# Altium schematic sheet Sheet4_PSU.SchDoc: =ProjectName
size A4; DocumentNumber: 4; SheetNumber: 4; SheetTotal: 4
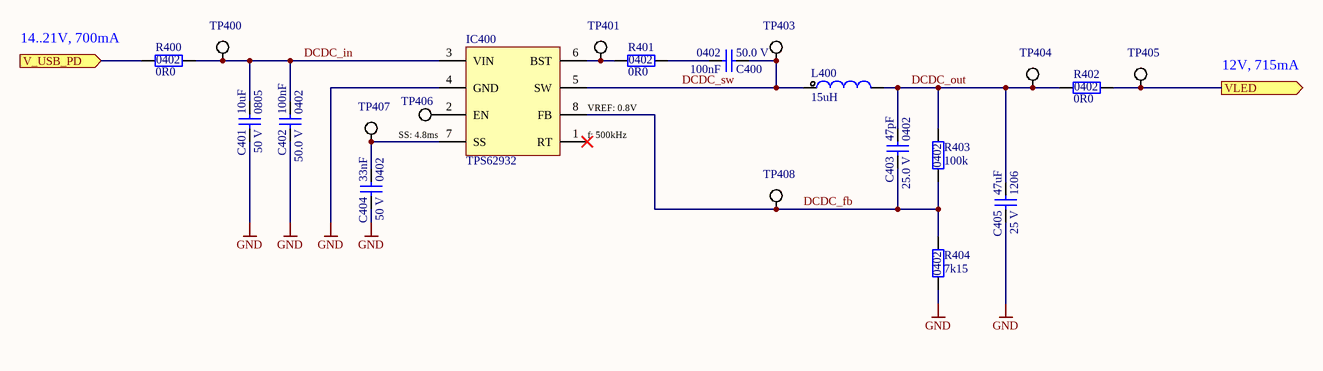
[diagram p0: Sheet4_PSU.SchDoc]

## Parts
C400  Capacitance: 100nF  Footprint: 0402  Voltage: 50.0 V  [C_0402]  (hidden comment: C 100nF 0402 50V)
C401  Capacitance: 10uF  Footprint: 0805  Voltage: 50 V  [C_0805]  (hidden comment: C 10uF 0805 50V)
C402  Capacitance: 100nF  Footprint: 0402  Voltage: 50.0 V  [C_0402]  (hidden comment: C 100nF 0402 50V)
C403  Capacitance: 47pF  Footprint: 0402  Voltage: 25.0 V  [C_0402]  (hidden comment: C 47pF 0402 25V)
C404  Capacitance: 33nF  Footprint: 0402  Voltage: 50 V  [C_0402]  (hidden comment: C 33nF 0402 50V)
C405  Capacitance: 47uF  Footprint: 1206  Voltage: 25 V  [C_1206]  (hidden comment: C 47uF 1206 25V)
IC400  TPS62932  [SOT-583]
L400  Inductance: 15uH  [L_7447709150]  (hidden comment: L 15uH 6.5A)
R400  Resistance: 0R0  Footprint: 0402  [R_0402]  (hidden comment: R 0R0 0402)
R401  Resistance: 0R0  Footprint: 0402  [R_0402]  (hidden comment: R 0R0 0402)
R402  Resistance: 0R0  Footprint: 0402  [R_0402]  (hidden comment: R 0R0 0402)
R403  Resistance: 100k  Footprint: 0402  [R_0402]  (hidden comment: R 100k 0402)
R404  Resistance: 7k15  Footprint: 0402  [R_0402]  (hidden comment: R 7k15 0402)
TP400  TP  [TP_1mm]  (value not drawn)  (net tie, no BOM)
TP401  TP  [TP_1mm]  (value not drawn)  (net tie, no BOM)
TP403  TP  [TP_1mm]  (value not drawn)  (net tie, no BOM)
TP404  TP  [TP_1mm]  (value not drawn)  (net tie, no BOM)
TP405  TP  [TP_1mm]  (value not drawn)  (net tie, no BOM)
TP406  TP  [TP_1mm]  (value not drawn)  (net tie, no BOM)
TP407  TP  [TP_1mm]  (value not drawn)  (net tie, no BOM)
TP408  TP  [TP_1mm]  (value not drawn)  (net tie, no BOM)

## Ports
V_USB_PD (in), VLED (out)

## Nets
GND: C401.1 C402.1 C404.1 C405.1 IC400.4(GND) R404.1
DCDC_fb: C403.1 IC400.8(FB) R403.1 R404.2 TP408.1(TP)
DCDC_in: C401.2 C402.2 IC400.3(VIN) R400.2 TP400.1(TP)
DCDC_out: C403.2 C405.2 L400.2 R402.1 R403.2 TP404.1(TP)
DCDC_sw: C400.1 IC400.5(SW) L400.1 TP403.1(TP)
V_USB_PD: R400.1 ; port V_USB_PD
VLED: R402.2 TP405.1(TP) ; port VLED
NetC400_2: C400.2 R401.2
NetC404_2: C404.2 IC400.7(SS) TP407.1(TP)
NetIC400_2: IC400.2(EN) TP406.1(TP)
NetIC400_6: IC400.6(BST) R401.1 TP401.1(TP)

Not connected (* = marked no-connect by the designer): IC400 1(RT)*

## Notes on the sheet
- (near R400) 14..21V, 700mA
- VREF: 0.8V
- 12V, 715mA
- SS: 4.8ms
- (near IC400) f: 500kHz
- Title
- Size:
- Date:
- A4
- Number:
- Time:
- Revision:
- Sheet
- of
- File:

## Library data of the parts
C400 C402 = CAP_100nF_50V_0402: CAP CER 0.1UF 50V X7R 0402; Manufacturer: Murata Electronics; Manufacturer Part Number: GRM155R71H104KE14J; Type: Capacitor; Supplier 1: Digi-Key; Supplier Part Number 1: 490-13342-1-ND
C401 = CAP_10uF_50V_0805: CAP CER 10UF 50V X5R 0805; Manufacturer: Murata Electronics; Manufacturer Part Number: GRM21BR61H106KE43K; Type: Capacitor; Supplier 1: Digi-Key; Supplier Part Number 1: 490-GRM21BR61H106KE43KTR-ND
C403 = CAP_47pF_25V_0402: CAP CER 47PF 25V C0G/NP0 0402; Manufacturer: KEMET; Manufacturer Part Number: C0402C470J3GAC7867; Type: Capacitor; Supplier 1: Digi-Key; Supplier Part Number 1: 399-C0402C470J3GAC7867CT-ND
C404 = CAP_33nF_50V_0402: CAP CER 0.033UF 50V X7R 0402; Manufacturer: Murata Electronics; Manufacturer Part Number: GCM155R71H333KE02J; Type: Capacitor; Supplier 1: Digi-Key; Supplier Part Number 1: 490-GCM155R71H333KE02JTR-ND
C405 = CAP_47uF_25V_1206: CAP CER 47UF 25V X5R 1206; Manufacturer: Murata Electronics; Manufacturer Part Number: GRM31CR61E476ME44K; Type: Capacitor; Supplier 1: Digi-Key; Supplier Part Number 1: GRM31CR61E476ME44K
IC400 = IC_Reg_TPS62932DRLR: IC REG BUCK ADJ 2A SOT583; Manufacturer: Texas Instruments; Manufacturer Part Number: TPS62932DRLR; Type: IC, Regulator; Supplier 1: Digi-Key; Supplier Part Number 1: 296-TPS62932DRLRTR-ND
L400 = L_15uH_6.5A: FIXED IND 15UH 6.5A 26 MOHM SMD; Manufacturer: Würth Elektronik; Manufacturer Part Number: 7447709150; Type: Inductor; Supplier 1: Digi-Key; Supplier Part Number 1: 732-7447709150TR-ND
R400-R402 = R_0R0_0402: RES 0 OHM JUMPER 1/16W 0402; Manufacturer: Stackpole Electronics Inc; Manufacturer Part Number: RMCF0402ZT0R00; Type: Resistor; Supplier 1: Digi-Key; Supplier Part Number 1: RMCF0402ZT0R00CT-ND
R403 = R_100k_0402: RES 100K OHM 5% 1/16W 0402; Manufacturer: YAGEO; Manufacturer Part Number: RC0402JR-07100KL; Type: Resistor; Supplier 1: Digi-Key; Supplier Part Number 1: 311-100KJRCT-ND
R404 = R_7k15_0402: RES 7.15K OHM 1% 1/16W 0402; Manufacturer: Stackpole Electronics Inc; Manufacturer Part Number: RMCF0402FT7K15; Type: Resistor; Supplier 1: Digi-Key; Supplier Part Number 1: RMCF0402FT7K15CT-ND
TP400 TP401 TP403-TP408 = TP_1mm: Test Point 1mm